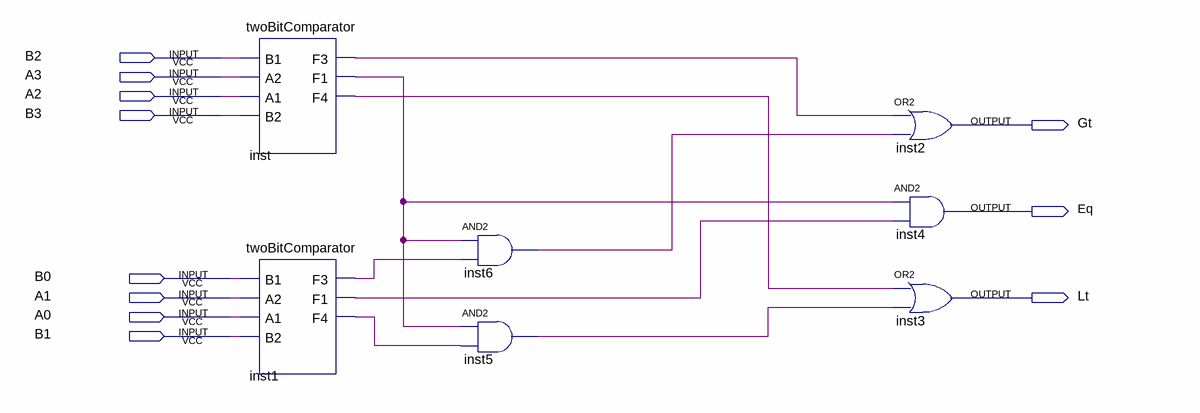
[diagram p0: schematic sheet]
// Quartus schematic newComparator.bdf as structural Verilog: 7 symbols, 11 pins
module newComparator (
  input  B2,
  input  A3,
  input  A2,
  input  B3,
  input  B0,
  input  A1,
  input  A0,
  input  B1,
  output Gt,
  output Eq,
  output Lt
);

  wire inst1_f1, inst1_f3, inst1_f4, inst5_out, inst6_out, inst_f1, inst_f3, inst_f4;

  twoBitComparator inst (.B1(B2), .A2(A3), .A1(A2), .B2(B3), .F3(inst_f3), .F1(inst_f1), .F4(inst_f4));
  twoBitComparator inst1 (.B1(B0), .A2(A1), .A1(A0), .B2(B1), .F3(inst1_f3), .F1(inst1_f1), .F4(inst1_f4));
  and inst6 (inst6_out, inst_f1, inst1_f3);
  and inst5 (inst5_out, inst_f1, inst1_f4);
  or inst2 (Gt, inst_f3, inst6_out);
  and inst4 (Eq, inst_f1, inst1_f1);
  or inst3 (Lt, inst_f4, inst5_out);
endmodule
